# Altium project Arduino Leonardo Shield_V2.PrjPcb
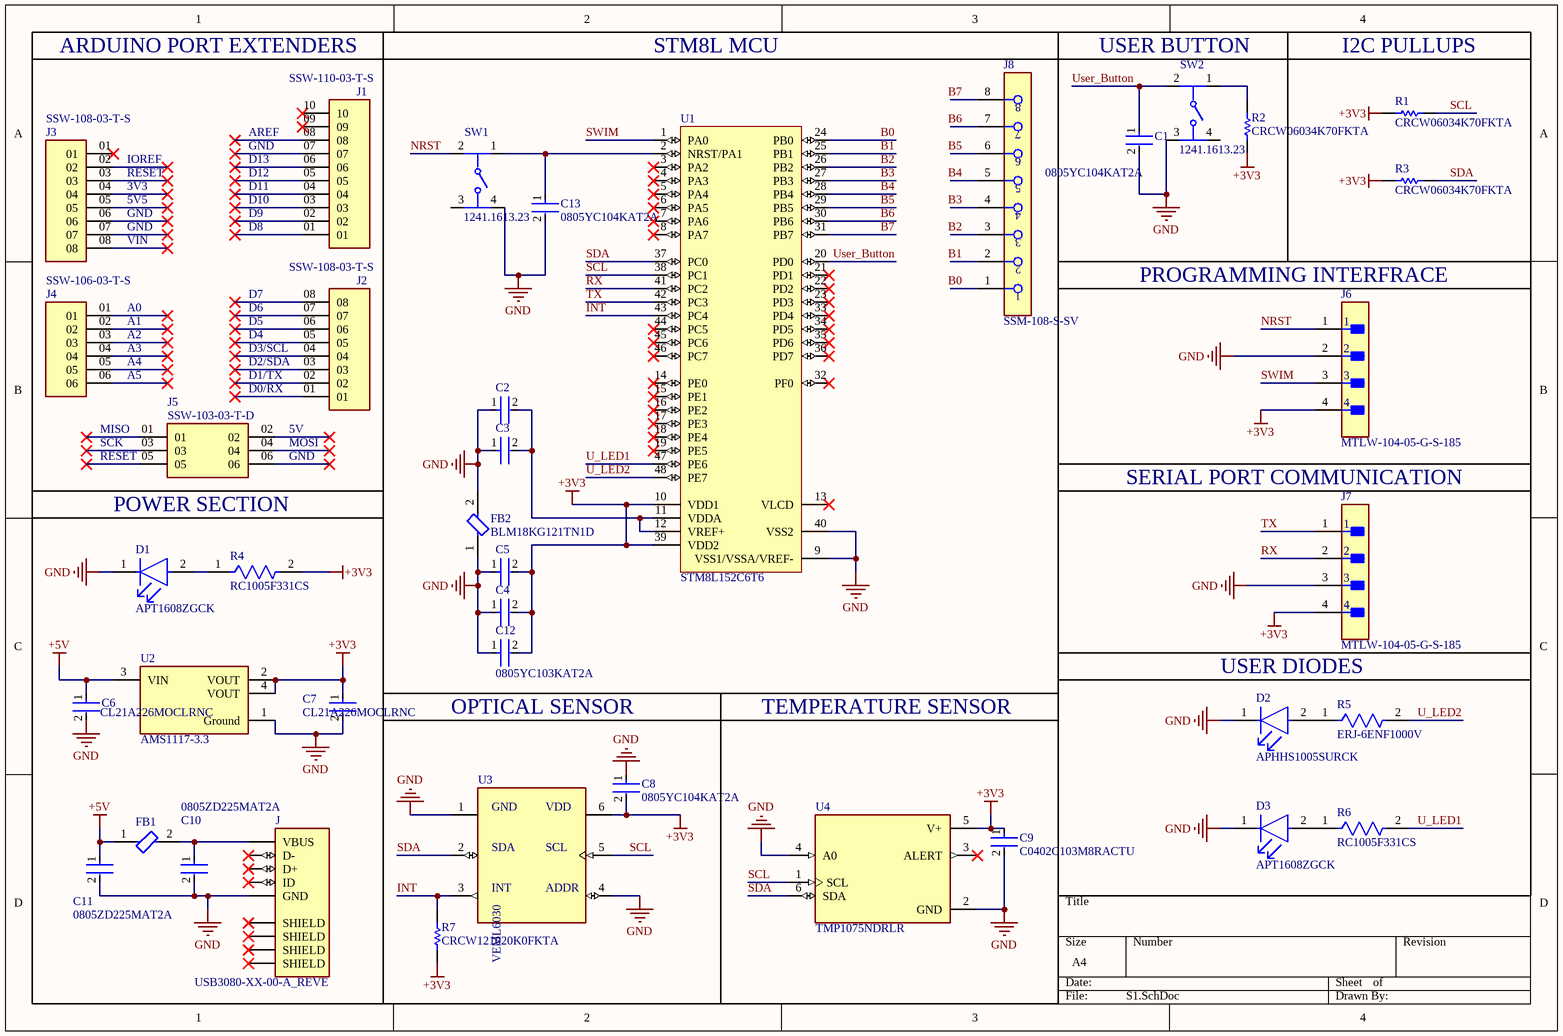
[diagram p0: S1.SchDoc]
1 sheet, 40 parts. Net scope: global (net labels, ports and power ports of the same name join across sheets).
Board file: PCB1_AUTO.PcbDoc

## Sheet S1.SchDoc
size A4; SheetNumber: 1; SheetTotal: 1

### Parts
C1  0805YC104KAT2A  [FP-0805-L_2_01_0_2-W_1_25-MFG]
C2  0805YC104KAT2A  [FP-0805-L_2_01_0_2-W_1_25-MFG]  (value not drawn)
C3  0805YC104KAT2A  [FP-0805-L_2_01_0_2-W_1_25-MFG]  (value not drawn)
C4  0805YC104KAT2A  [FP-0805-L_2_01_0_2-W_1_25-MFG]  (value not drawn)
C5  0805YC104KAT2A  [FP-0805-L_2_01_0_2-W_1_25-MFG]  (value not drawn)
C6  CL21A226MOCLRNC  [FP-CL21-IPC_C]
C7  CL21A226MOCLRNC  [FP-CL21-IPC_C]
C8  0805YC104KAT2A  [FP-0805-L_2_01_0_2-W_1_25-MFG]
C9  C0402C103M8RACTU  [FP-C0402-BB-MFG]
C10  0805ZD225MAT2A  [FP-0805-L_2_01_0_2-W_1_25-IPC_B]
C11  0805ZD225MAT2A  [FP-0805-L_2_01_0_2-W_1_25-IPC_B]
C12  0805YC103KAT2A  [FP-0805-L_2_01_0_2-W_1_25-IPC_C]
C13  0805YC104KAT2A  [FP-0805-L_2_01_0_2-W_1_25-MFG]
D1  APT1608ZGCK  [FP-APT1608ZGCK-MFG]
D2  APHHS1005SURCK  [FP-APHHS1005SURCK-MFG]
D3  APT1608ZGCK  [FP-APT1608ZGCK-MFG]
FB1  BLM18KG121TN1D  [FP-BLM18-0_15-t0_6-d1_2-IPC_A]  (value not drawn)
FB2  BLM18KG121TN1D  [FP-BLM18-0_15-t0_6-d1_2-IPC_A]
J  USB3080-XX-00-A_REVE  [GCT_USB3080-XX-00-A_REVE]
J1  SSW-110-03-T-S  [SAMTEC_SSW-110-03-T-S]
J2  SSW-108-03-T-S  [SAMTEC_SSW-108-XX-X-S]
J3  SSW-108-03-T-S  [SAMTEC_SSW-108-XX-X-S]
J4  SSW-106-03-T-S  [SAMTEC_SSW-106-03-T-S]
J5  SSW-103-03-T-D  [SAMTEC_SSW-103-03-T-D]
J6  MTLW-104-05-G-S-185  [FP-MTLW-104-05-G-S-185-MFG]
J7  MTLW-104-05-G-S-185  [FP-MTLW-104-05-G-S-185-MFG]
J8  SSM-108-S-SV  [FP-SSM-108-S-SV-MFG]
R1  CRCW06034K70FKTA  [RESC1609X50X30NL10T20]
R2  CRCW06034K70FKTA  [RESC1609X50X30NL10T20]
R3  CRCW06034K70FKTA  [RESC1609X50X30NL10T20]
R4  RC1005F331CS  [FP-RC1005-IPC_B]
R5  ERJ-6ENF1000V  [FP-ERJ6EN-MFG]
R6  RC1005F331CS  [FP-RC1005-IPC_B]
R7  CRCW121020K0FKTA  [RESC3225X60X45LL20T20]
SW1  1241.1613.23  [FP-1241_1613_23-MFG]
SW2  1241.1613.23  [FP-1241_1613_23-MFG]
U1  STM8L152C6T6  [LQFP48_M]
U2  AMS1117-3.3  [FP-AMS1117-IPC_C]
U3  VEML6030  [VISHAY_VEML6030_2X2X0.87]
U4  TMP1075NDRLR  [SOT50P160X60-6N]

### Nets
+3V3: C4.2 C5.2 C7.1 C8.2 C9.1 C12.2 J6.4 J7.4 R1.1 R2.1 R3.1 R4.2 R7.1 U1.10(VDD1) U1.39(VDD2) U2.2(VOUT) U2.4(VOUT) U3.6(VDD) U4.5(V+)
+5V: C6.1 C11.1 FB1.1 U2.3(VIN)
GND: C1.2 C2.1 C3.1 C4.1 C5.1 C6.2 C7.2 C8.1 C9.2 C10.2 C11.2 C12.1 C13.2 D1.1(C) D2.1(C) D3.1(C) FB2.1 FB2.2 J.5(GND) J6.2 J7.3 SW1.4 SW2.3 U1.9(VSS1/VSSA/VREF-) U1.40(VSS2) U2.1(Ground) U3.1(GND) U3.4(ADDR) U4.2(GND) U4.4(A0)
B0: J8.1 U1.24(PB0)
B1: J8.2 U1.25(PB1)
B2: J8.3 U1.26(PB2)
B3: J8.4 U1.27(PB3)
B4: J8.5 U1.28(PB4)
B5: J8.6 U1.29(PB5)
B6: J8.7 U1.30(PB6)
B7: J8.8 U1.31(PB7)
INT: R7.2 U1.43(PC4) U3.3(INT)
NRST: J6.1 SW1.2
RX: J7.2 U1.41(PC2)
SCL: R1.2 U1.38(PC1) U3.5(SCL) U4.1(SCL)
SDA: R3.2 U1.37(PC0) U3.2(SDA) U4.6(SDA)
SWIM: J6.3 U1.1(PA0)
TX: J7.1 U1.42(PC3)
U_LED1: R6.2 U1.47(PE6)
U_LED2: R5.2 U1.48(PE7)
User_Button: C1.1 SW2.2 U1.20(PD0)
NetC2_2: C2.2 C3.2 U1.11(VDDA) U1.12(VREF+)
NetC10_1: C10.1 FB1.2 J.1(VBUS)
NetC13_1: C13.1 SW1.1 U1.2(NRST/PA1)
NetD1_2: D1.2(A) R4.1
NetD2_2: D2.2(A) R5.1
NetD3_2: D3.2(A) R6.1
NetR2_2: R2.2 SW2.1

Not connected (* = marked no-connect by the designer): J 2(D-)* 3(D+)* 4(ID)* 6(SHIELD)* 7(SHIELD)* 8(SHIELD)* 9(SHIELD)*; J1 01* 02* 03* 04* 05* 06* 07* 08* 09* 10*; J2 01* 02* 03* 04* 05* 06* 07* 08*; J3 01* 02* 03* 04* 05* 06* 07* 08*; J4 01* 02* 03* 04* 05* 06*; J5 01* 02* 03* 04* 05* 06*; SW1 3; SW2 4; U1 3(PA2)* 4(PA3)* 5(PA4)* 6(PA5)* 7(PA6)* 8(PA7)* 13(VLCD)* 14(PE0)* 15(PE1)* 16(PE2)* 17(PE3)* 18(PE4)* 19(PE5)* 21(PD1)* 22(PD2)* 23(PD3)* 32(PF0)* 33(PD4)* 34(PD5)* 35(PD6)* 36(PD7)* 44(PC5)* 45(PC6)* 46(PC7)*; U4 3(ALERT)*

### Notes on the sheet
- ARDUINO PORT EXTENDERS
- STM8L MCU
- (near SW2) USER BUTTON
- I2C PULLUPS
- (near J3) RESET
- (near J3) IOREF
- D12
- D13
- GND
- AREF
- (near J3) 3V3
- (near J3) 5V5
- (near J3) GND
- (near J3) VIN
- D8
- D9
- D10
- D11
- (near J4) A0
- D7
- D6
- (near J6) PROGRAMMING INTERFRACE
- (near J4) A1
- (near J4) A2
- (near J4) A3
- (near J4) A4
- A5
- D5
- D4
- (near J2) D3/SCL
- D2/SDA
- D1/TX
- MISO
- SCK
- D0/RX
- MOSI
- 5V
- (near J5) RESET
- (near J5) POWER SECTION
- SERIAL PORT COMMUNICATION
- OPTICAL SENSOR
- TEMPERATURE SENSOR
- USER DIODES

### Library data of the parts
C1-C5 C8 C13 = CMP-2007-04454-2: General Purpose Ceramic Capacitor, 0805, 100nF, 10%, X7R, 0.15, 16V; Insulation Resistance: 100GR; Dissipation Factor: 12.5%; Mount: Surface Mount; REACH SVHC: No SVHC; Case Code (Metric): 2012; Length: 2.01mm; RoHS Compliant: Yes; Number of Pins: 2; Packaging: Tape and Reel; Lead Free: Lead Free; Tolerance: 10%; Min Operating Temperature: -55°C; Voltage Rating (DC): 16V; Capacitance: 100nF; Thickness: 0.037inch; Series: -; Dielectric: X7R; Radiation Hardening: No; Construction: Flat; Depth: 1.25mm; Width: 0.049inch; Max Operating Temperature: 125°C; Case/Package: 0805; Package Quantity: 1; Voltage Rating: 16V; Termination: SMD/SMT; Case Code (Imperial): 0805
C6 C7 = CMP-13271-002990-1: CL21 Series 0805 22uF 16V ±20% Tolerance X5R Multilayer Ceramic Chip Capacitor; Case Code (Imperial): 0805; Capacitance: 22uF; Max Operating Temperature: 85°C; Min Operating Temperature: -55°C; Packaging: Tape and Reel; Case Code (Metric): 2012; Case/Package: 0805; Mount: Surface Mount; Tolerance: 20%; Thickness: 0.037inch; Voltage Rating: 16V; Width: 0.049inch; Length: 0.079inch
C9 = CMP-2008-03079-2: CAP CER 10000PF 10V X7R 0402; Manufacturer: Kemet; Tolerance: 0.2; Material: Ceramic; Temperature Coefficient: 15%; Value: 10,000 pF; Voltage Rating: 10 V; ComponentLink2URL: https://content.kemet.com/datasheets/KEM_C1002_X7R_SMD.pdf; Octopart: https://octopart.com/c0402c103m8ractu-kemet-12595671; RoHS: TRUE; Automotive: No; Category: Cap; Temperature Range Low: -55°C; Package: C0402-BB; Lead Free: Yes; Ipc Land Pattern Name: CAPC10050X50; Height: 0.55mm; ComponentLink2Description: Datasheet; Temperature Characteristic: X7R; Mouser Description: Multilayer Ceramic Capacitors MLCC - SMD/SMT 10volts 10000pF X7R 20%; Manufacturer Part Number: C0402C103M8RACTU; Temperature Range High: +125°C; Digikey Description: CAP CER 10000PF 10V X7R 0402; Device Class L1: Passive Components; Capacitance: 10,000 pF; Temperature: -55°C to +125°C; Device Class L3: Ceramic Capacitors; Device Class L2: Capacitors
C10 C11 = CMP-2007-04684-2: General Purpose Ceramic Capacitor, 0805, 2.2uF, 20%, X5R, 15%, 10V; Dissipation Factor: 5%; Voltage Rating: 10V; Case Code (Imperial): 0805; Capacitance: 2.2uF; Packaging: Tape and Reel; Series: -; Package Quantity: 1; Max Operating Temperature: 85°C; Depth: 1.25mm; Case/Package: 0805; Height: 1.4mm; Mount: Surface Mount; REACH SVHC: No SVHC; Lead Free: Lead Free; Dielectric: X5R; Construction: Flat; Length: 2.01mm; Radiation Hardening: No; Case Code (Metric): 2012; Voltage Rating (DC): 10V; Number of Pins: 2; Min Operating Temperature: -55°C; Thickness: 0.055inch; Termination: SMD/SMT; Width: 0.049inch; RoHS Compliant: Yes; Tolerance: 20%
C12 = CMP-2007-04708-2: General Purpose Ceramic Capacitor, 0805, 10nF, 10%, X7R, 0.15, 16V; Dissipation Factor: 3.5%; Number of Pins: 2; Depth: 1.25mm; Min Operating Temperature: -55°C; Max Operating Temperature: 125°C; Voltage Rating: 16V; RoHS Compliant: Yes; Width: 0.049inch; Case/Package: 0805; Height: 0.94mm; REACH SVHC: No SVHC; Construction: Flat; Dielectric: X7R; Tolerance: 10%; Length: 2.01mm; Radiation Hardening: No; Lead Free: Lead Free; Capacitance: 10nF; Mount: Surface Mount; Dielectric Material: Ceramic; Case Code (Metric): 2012; Package Quantity: 4000; Packaging: Tape and Reel; Termination: SMD/SMT; Voltage Rating (DC): 16V; Case Code (Imperial): 0805; Thickness: 0.037inch
D1 D3 = CMP-44529-000024-1: LED GREEN CLEAR CHIP SMD; Forward Voltage: 3.3V; Dominant Wavelength: 525nm; Forward Current: 20mA; Lens Color: Colorless; Viewing Angle: 120°; Luminous Intensity: 350mcd; Lens Transparency: Clear; Color: Green; Max Operating Temperature: 85°C; Case/Package: 0603; Mount: Surface Mount; Min Operating Temperature: -40°C; Case Code (Metric): 1608; Test Current: 20mA; Packaging: Tape and Reel; Width: 0.8mm; Package Quantity: 1; Height: 0.75mm; Length: 1.6mm; Illumination Color: Green; Lead Free: Lead Free; Case Code (Imperial): 0603
D2 = CMP-2000-05787-2: LED RED CLEAR CHIP SMD; Forward Current: 20mA; Number of LEDs: 1; Dominant Wavelength: 630nm; Luminous Intensity: 220mcd; Wavelength: 635nm; Forward Voltage: 1.95V; Viewing Angle: 120°; Case/Package: 0402; Length: 1mm; Packaging: Tape and Reel; Lens Color: Clear; Width: 0.5mm; Test Current: 20mA; Lead Free: Lead Free; Min Operating Temperature: -40°C; Illumination Color: Red; Max Operating Temperature: 85°C; Mount: Surface Mount; Package Quantity: 2000; Lens Style: Clear; Case Code (Imperial): 0402; Height: 0.6mm; Number of Pins: 2; Case Code (Metric): 1005; Color: Red
FB1 FB2 = CMP-0686-00554-8: FERRITE BEAD 120 OHM 0603 1LN; Max Current Rating: 3A; DC Resistance (DCR): 30mR; Impedance: 120R; Number of Lines: 1; Test Frequency: 100MHz; Tolerance: 25%; Package Quantity: 4000; Min Operating Temperature: -55°C; Termination: SMD/SMT; REACH SVHC: No SVHC; Core Material: Ferrite; Material: Ferrite; Current Rating: 3A; Height: 0.8mm; Number of Pins: 2; Case/Package: 0603; Case Code (Imperial): 0603; Series: BLM18K; Packaging: Tape and Reel; Inductor Type: FERRITE BEAD; Lead Free: Lead Free; Width: 0.8mm; Case Code (Metric): 1608; Number of Circuits: 1; Max DC Current: 3A; Depth: 0.95mm; Max Operating Temperature: 125°C; Length: 1.6mm; RoHS Compliant: Yes
J = USB3080-XX-00-A_REVE: USB - micro B USB 2.0 Receptacle Connector 5 Position Surface Mount, Right Angle; MF: Global Connector Technology; MP: USB3080-30-00-A; Availability: Unavailable; SnapEDA_Link: https://www.snapeda.com/parts/USB3080-30-00-A/Global%20Connector%20Technology/view-part/697012/?ref=snap; Price: None; Package: None; Value: *
J1 = SSW-110-03-T-S: MF: Samtec; Availability: Unavailable; Price: None; Package: None; Value: *; MP: SSW-110-03-T-S
J2 J3 = SSW-108-XX-X-S: 8 Position Receptacle Connector Through Hole, Right Angle; MP: SSW-108-03-F-S; MF: Samtec; Availability: Bad; Purchase-URL: https://pricing.snapeda.com/search/part/SSW-108-03-F-S/?ref=eda; SnapEDA_Link: https://www.snapeda.com/parts/SSW-108-03-F-S/Samtec/view-part/3433832/?ref=snap; Price: None; Value: *; Check_prices: https://www.snapeda.com/parts/SSW-108-03-F-S/Samtec/view-part/3433832/?ref=eda; Package: None
J4 = SSW-106-03-T-S: MF: Samtec Inc.; Availability: Unavailable; Price: None; Value: *; MP: SSW-106-03-T-S; Package: None
J5 = SSW-103-03-T-D: SSW Series .100 Tiger Buyâ„¢ Socket Strip; MF: Samtec; Price: None; Check_prices: https://www.snapeda.com/parts/SSW-103-03-T-D/Samtec/view-part/?ref=eda; Package: None; SnapEDA_Link: https://www.snapeda.com/parts/SSW-103-03-T-D/Samtec/view-part/?ref=snap; Purchase-URL: https://pricing.snapeda.com/search/part/SSW-103-03-T-D/?ref=eda; Availability: In Stock; MP: SSW-103-03-T-D; Value: *
J6 J7 = CMP-02766-000562-1: CONN HEADER VERT 4POS 2.54MM; Number of Contacts: 4; Contact Resistance: 15mR; Connector Type: Male Pin; Gender: Male; Contact Material: Brass; Height: 6.4mm; Contact Mating Length: 0.185inch; Length: 29.64mm; Number of Positions: 4; Packaging: Rail/Tube; Mount: Through Hole; Depth: 2.48mm; Number of Rows: 1; Radiation Hardening: No; Housing Material: Polymer; Pitch: 2.54mm; Max Operating Temperature: 105°C; Termination: Solder; Min Operating Temperature: -40°C; Color: Black; Orientation: Straight; Housing Color: Black; Contact Plating: Gold
J8 = CMP-02766-001390-1: CONN RCPT 8POS 0.1 GOLD SMD; Contact Resistance: 10mR; Pitch: 2.54mm; Max Current Rating: 6.9A; Connector Type: Receptacle; Max Voltage Rating (AC): 475V; Number of Positions: 8; Gender: Female; RoHS Compliant: Yes; Orientation: Straight; Width: 2.54mm; Number of Rows: 1; Housing Color: Black; Housing Material: Polymer; Length: 20.32mm; Min Operating Temperature: -55°C; Max Operating Temperature: 125°C; Contact Type: Female Socket; Contact Material: Bronze; Radiation Hardening: No; Color: Black; Depth: 4.42mm; Packaging: Bulk; Mount: Surface Mount; Contact Plating: Gold; Termination: Solder; Series: SSM; Number of Contacts: 8; Lead Free: Lead Free
R1-R3 = CMP-2000-03412-1: Manufacturer: Vishay Dale; Part Number: CRCW06034K70FKTA
R4 R6 = CMP-13261-004965-1: Res Thick Film 0402 330Ω 1% 0.063W ±100ppm/°C Molded SMD T/R; Resistance: 330R; Max Power Dissipation: 63mW; Contact Plating: Tin; Case/Package: 0402; Width: 0.02inch; Min Operating Temperature: -55°C; Composition: Thick Film; Package Quantity: 1; Length: 0.039inch; Case Code (Imperial): 0402; Case Code (Metric): 1005; Height: 0.016inch; Features: Moisture Resistant; Radiation Hardening: No; Military Standard: Not; Depth: 0.5mm; Temperature Coefficient: 100ppm/°C; Max Operating Temperature: 155°C; Packaging: Tape and Reel; Tolerance: 1%; Number of Terminations: 2; Power Rating: 63mW
R5 = CMP-2001-04374-6: RES SMD 100 OHM 1% 1/8W 0805; Resistance: 100R; Temperature Coefficient: 100ppm/°C; Voltage Rating (DC): 150V; Max Power Dissipation: 125mW; Case Code (Imperial): 0805; Termination: SMD/SMT; Number of Pins: 2; Case Code (Metric): 2012; Resistor Type: Thick Film; Lead Free: Lead Free; Series: ERJ; Size Code: 0805; Min Operating Temperature: -55°C; RoHS Compliant: Yes; Radiation Hardening: No; Technology: THICK FILM; Contact Plating: Tin; Length: 2mm; Resistance Tolerance: 1%; Military Standard: Not; Case/Package: 0805; REACH SVHC: No SVHC; Max Operating Temperature: 155°C; Construction: Rectangular; Packaging: Tape and Reel; Tolerance: 1%; Voltage Rating: 150V; Power Rating: 125mW; Depth: 1.25mm; Width: 1.2mm; Package Quantity: 1; Mount: Surface Mount; Height: 0.6mm; Number of Terminations: 2; Features: Automotive AEC-Q200
R7 = CMP-1015-00655-2: Manufacturer: Vishay Dale; Part Number: CRCW121020K0FKTA
SW1 SW2 = CMP-26316-000007-1: SWITCH TACTILE SPST-NO 0.05A 42V; Actuator Type: Standard; Actuator Material: Polyphenylene; Operating Force: 1.8N; Ratings: IP40; Switch Travel: 0.35mm; Voltage Rating (AC): 30V; Mechanical Life: 1000000Cycles; Current Rating: 50mA; Throw Configuration: SPST; Switch Function: Off-Mom; Illumination Type: Non-Illuminated; Max Operating Temperature: 85°C; Voltage Rating (DC): 42V; Weight: 0.028219oz; Orientation: Straight; Min Operating Temperature: -40°C; Package Quantity: 450; Radiation Hardening: No; Depth: 11.8mm; RoHS Compliant: Yes; Case/Package: SMD/SMT; Max Voltage Rating (DC): 42V; Series: SMS; Termination: J-Lead; Max Voltage Rating (AC): 30V; Mount: Surface Mount; Packaging: Tape and Reel; Max Current Rating: 50mA; Contact Material: Gold; Length: 11.4mm
U1 = CMP-0235-00048-1: STM8L ARM-based EnergyLite 8-bit MCU, LCD, 32 kB Flash, 2 kB Internal RAM, -40 to +85°C Temperature, 48-pin LQFP, Tray; ComponentLink1URL: http://www.st.com/internet/com/TECHNICAL_RESOURCES/TECHNICAL_LITERATURE/DATASHEET/CD00240181.pdf; ComponentLink2Description: STM8L Family Web Page; ComponentLink3URL: http://www.st.com/internet/com/home/home.jsp; ComponentLink1Description: STM8L151/152,x4,x6 Datasheet; PackageVersion: rev13, Apr-2011; PackageDescription: 48-Pin Low-Profile Quad Flat Pack, 7 x 7 mm Body, 0.5 mm Pitch (LQFP48); PackageReference: LQFP48; ComponentLink2URL: http://www.st.com/internet/mcu/subclass/1381.jsp; ComponentLink3Description: st.com Home
U2 = CMP-209535-000001-1: LDO Voltage Regulators 1A, 3.3V; Manufacturer: Advanced Monolithic Systems; Dropout Voltage: 1.1V; Output Type: Fixed; Nominal Supply Current: 5mA; Max Power Dissipation: 1.2W; Max Supply Voltage: 15V; Number Of Outputs: 1; Standoff Height: 0.64mm; Max Junction Temp: +125°C; Height: 1.8mm; Package: AMS1117; Device Class L2: Power Management ICs; ComponentLink2Description: Datasheet; ComponentLink2URL: http://www.advanced-monolithic.com/pdf/ds1117.pdf; Category: IC; RoHS: TRUE; Automotive: No; Device Class L1: Integrated Circuits (ICs); Output Current: 1A; Device Class L3: Voltage Regulators - Linear; Temperature: -40°C to +125°C; Output Voltage: 3.3V; Manufacturer Part Number: AMS1117-3.3; Temperature Range Low: -40°C; Octopart: https://octopart.com/ams1117-3.3-advanced+monolithic+systems-25899300; Lead Free: Yes; Ipc Land Pattern Name: SOT229P700X180-4; Temperature Range High: +125°C
U3 = VEML6030: Optical Sensor Ambient 550nm IÂ²C 6-SMD, No Lead; MF: Vishay; SnapEDA_Link: https://www.snapeda.com/parts/VEML6030/Vishay+Semiconductor+Opto+Division/view-part/?ref=snap; Price: None; MP: VEML6030; Check_prices: https://www.snapeda.com/parts/VEML6030/Vishay+Semiconductor+Opto+Division/view-part/?ref=eda; Availability: In Stock; Value: *; Purchase-URL: https://pricing.snapeda.com/search/part/VEML6030/?ref=eda; Package: SMD-6 Vishay Semiconductor
U4 = TMP1075NDRLR: 1Â°C IÂ²C temperature sensor with performance upgrades to industry standard LM75 / TMP75; MF: Texas Instruments; Availability: In Stock; Check_prices: https://www.snapeda.com/parts/TMP1075NDRLR/Texas+Instruments/view-part/?ref=eda; Package: None; Price: None; Purchase-URL: https://pricing.snapeda.com/search/part/TMP1075NDRLR/?ref=eda; SnapEDA_Link: https://www.snapeda.com/parts/TMP1075NDRLR/Texas+Instruments/view-part/?ref=snap; Value: *; MP: TMP1075NDRLR